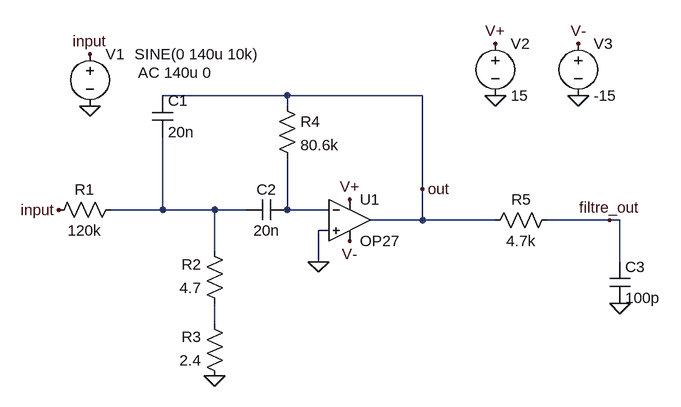
[diagram p0: schematic filtre.asc]
filtre.asc, the LTspice schematic file:
Version 4
SHEET 1 880 680
WIRE 128 32 -64 32
WIRE 336 32 128 32
WIRE 128 48 128 32
WIRE 336 176 336 32
WIRE -64 208 -64 96
WIRE -64 208 -144 208
WIRE 16 208 -64 208
WIRE 64 208 16 208
WIRE 128 208 128 128
WIRE 192 208 128 208
WIRE 336 224 336 176
WIRE 336 224 256 224
WIRE 448 224 336 224
WIRE 624 224 528 224
WIRE 640 224 624 224
WIRE 192 240 176 240
WIRE 16 272 16 208
WIRE 176 288 176 240
WIRE 640 288 640 224
WIRE 16 384 16 352
FLAG 16 464 0
FLAG 176 288 0
FLAG 640 352 0
FLAG 624 224 filtre_out
FLAG 336 176 out
FLAG -176 48 0
FLAG -176 -32 input
FLAG 224 192 V+
FLAG 224 256 V-
FLAG -224 208 input
FLAG 448 -48 V+
FLAG 576 -48 V-
FLAG 448 32 0
FLAG 576 32 0
SYMBOL res -128 192 R90
WINDOW 0 0 56 VBottom 2
WINDOW 3 32 56 VTop 2
SYMATTR InstName R1
SYMATTR Value 120k
SYMBOL res 32 368 R180
WINDOW 0 36 76 Left 2
WINDOW 3 36 40 Left 2
SYMATTR InstName R2
SYMATTR Value 4.7
SYMBOL res 32 480 R180
WINDOW 0 36 76 Left 2
WINDOW 3 36 40 Left 2
SYMATTR InstName R3
SYMATTR Value 2.4
SYMBOL cap -80 32 R0
SYMATTR InstName C1
SYMATTR Value 20n
SYMBOL cap 64 224 R270
WINDOW 0 32 32 VTop 2
WINDOW 3 0 32 VBottom 2
SYMATTR InstName C2
SYMATTR Value 20n
SYMBOL res 112 32 R0
SYMATTR InstName R4
SYMATTR Value 80.6k
SYMBOL OpAmps\\OP27 224 160 R0
SYMATTR InstName U1
SYMBOL res 544 208 R90
WINDOW 0 0 56 VBottom 2
WINDOW 3 32 56 VTop 2
SYMATTR InstName R5
SYMATTR Value 4.7k
SYMBOL cap 624 288 R0
SYMATTR InstName C3
SYMATTR Value 100p
SYMBOL voltage -176 -48 R0
WINDOW 3 69 16 Left 2
WINDOW 123 74 45 Left 2
WINDOW 39 0 0 Left 0
SYMATTR InstName V1
SYMATTR Value SINE(0 140u 10k)
SYMATTR Value2 AC 140u 0
SYMBOL voltage 448 -64 R0
WINDOW 123 0 0 Left 0
WINDOW 39 0 0 Left 0
SYMATTR InstName V2
SYMATTR Value 15
SYMBOL voltage 576 -64 R0
WINDOW 123 0 0 Left 0
WINDOW 39 0 0 Left 0
SYMATTR InstName V3
SYMATTR Value -15

The netlist it stands for:
* filtre.asc
R1 N001 input 120k
R2 N003 N001 4.7
R3 0 N003 2.4
C1 out N001 20n
C2 N001 N002 20n
R4 out N002 80.6k
XU1 0 N002 V+ V- out OP27  ; pins In+ In- V+ V- OUT
R5 filtre_out out 4.7k
C3 filtre_out 0 100p
V1 input 0 SINE(0 140u 10k) AC 140u 0
V2 V+ 0 15
V3 V- 0 -15
.lib ADI.lib
.backanno
.end